# EAGLE schematic vmem_test (EAGLE 6.2)
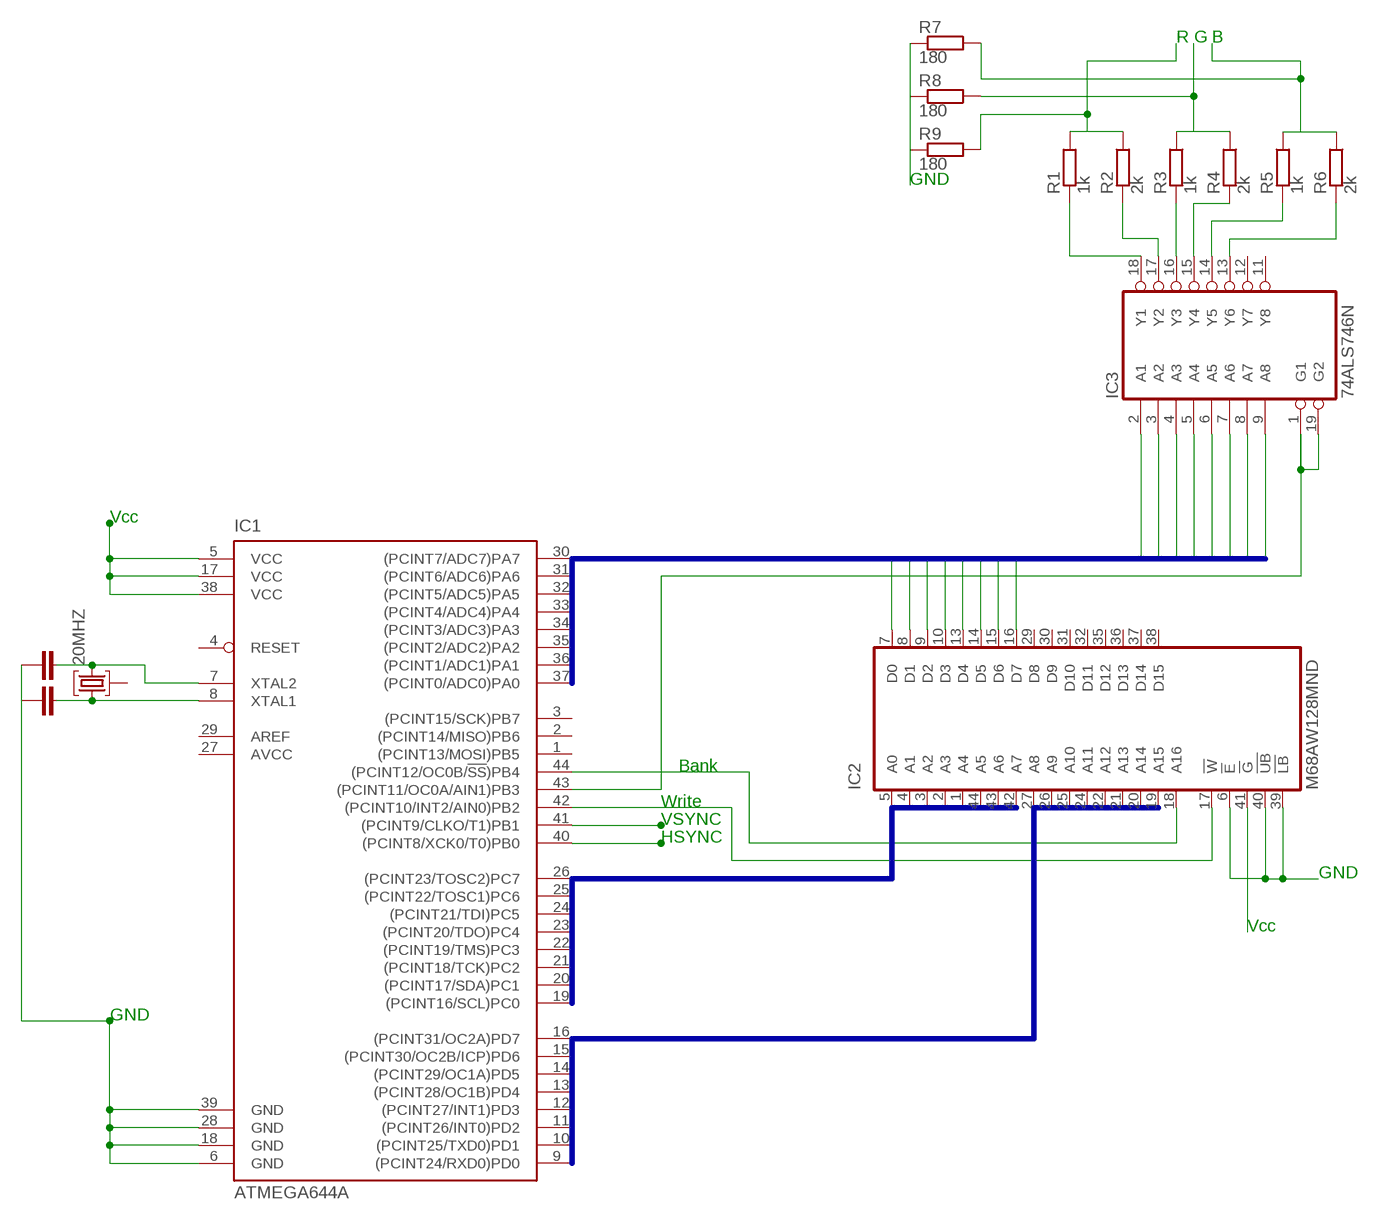
[diagram p0: schematic, sheet 1]

## Parts
20MHZ  12M10AHC49HT  [HC49U]
IC1  ATMEGA644A  [TQFP44]
IC2  M68AW128MND  [TSOP44-II]
IC3  74ALS746N  [DIL20]
R1  1k  BVS  [BVS]
R2  2k  BVS  [BVS]
R3  1k  BVS  [BVS]
R4  2k  BVS  [BVS]
R5  1k  BVS  [BVS]
R6  2k  BVS  [BVS]
R7  180  BVS  [BVS]
R8  180  BVS  [BVS]
R9  180  BVS  [BVS]

## Nets
N$1: IC1.5(VCC) IC1.17(VCC) IC1.38(VCC)
N$2: IC1.6(GND) IC1.18(GND) IC1.28(GND) IC1.39(GND)
N$3: IC2.7(D0)
N$4: IC2.8(D1)
N$5: IC2.9(D2)
N$6: IC2.10(D3)
N$7: IC2.13(D4)
N$8: IC2.14(D5)
N$9: 20MHZ.3 IC1.7(XTAL2)
N$10: 20MHZ.1 IC1.8(XTAL1)
N$11: IC2.15(D6)
N$12: IC2.16(D7)
N$13: IC3.2(A1)
N$14: IC3.3(A2)
N$15: IC3.4(A3)
N$16: IC3.5(A4)
N$17: IC3.6(A5)
N$18: IC3.7(A6)
N$19: IC3.8(A7)
N$20: IC3.9(A8)
N$21: IC1.40((PCINT8/XCK0/T0)PB0)
N$22: IC1.41((PCINT9/CLKO/T1)PB1)
N$23: IC2.41(!G)
N$24: IC2.6(!E) IC2.39(!LB) IC2.40(!UB)
N$25: IC1.43((PCINT11/OC0A/AIN1)PB3) IC3.1(G1) IC3.19(G2)
N$26: IC1.42((PCINT10/INT2/AIN0)PB2) IC2.17(!W)
N$27: IC3.18(Y1) R1.2
N$28: IC3.17(Y2) R2.2
N$29: IC3.16(Y3) R3.2
N$30: IC3.15(Y4) R4.2
N$31: IC3.13(Y6) R6.2
N$32: IC3.14(Y5) R5.2
N$33: R7.1
N$34: R3.1 R4.1 R8.1
N$35: R9.1
N$36: R1.1 R2.1
N$37: R5.1 R6.1
N$38: R7.2
N$40: IC1.44((PCINT12/OC0B/!SS!)PB4) IC2.18(A16)
Unconnected: 20MHZ.2 IC1.1((PCINT13/MOSI)PB5) IC1.2((PCINT14/MISO)PB6) IC1.3((PCINT15/SCK)PB7) IC1.4(RESET) IC1.9((PCINT24/RXD0)PD0) IC1.10((PCINT25/TXD0)PD1) IC1.11((PCINT26/INT0)PD2) IC1.12((PCINT27/INT1)PD3) IC1.13((PCINT28/OC1B)PD4) IC1.14((PCINT29/OC1A)PD5) IC1.15((PCINT30/OC2B/ICP)PD6) IC1.16((PCINT31/OC2A)PD7) IC1.19((PCINT16/SCL)PC0) IC1.20((PCINT17/SDA)PC1) IC1.21((PCINT18/TCK)PC2) IC1.22((PCINT19/TMS)PC3) IC1.23((PCINT20/TDO)PC4) IC1.24((PCINT21/TDI)PC5) IC1.25((PCINT22/TOSC1)PC6) IC1.26((PCINT23/TOSC2)PC7) IC1.29(AREF) IC1.30((PCINT7/ADC7)PA7) IC1.31((PCINT6/ADC6)PA6) IC1.32((PCINT5/ADC5)PA5) IC1.33((PCINT4/ADC4)PA4) IC1.34((PCINT3/ADC3)PA3) IC1.35((PCINT2/ADC2)PA2) IC1.36((PCINT1/ADC1)PA1) IC1.37((PCINT0/ADC0)PA0) IC2.1(A4) IC2.2(A3) IC2.3(A2) IC2.4(A1) IC2.5(A0) IC2.19(A15) IC2.20(A14) IC2.21(A13) IC2.22(A12) IC2.24(A11) IC2.25(A10) IC2.26(A9) IC2.27(A8) IC2.29(D8) IC2.30(D9) IC2.31(D10) IC2.32(D11) IC2.35(D12) IC2.36(D13) IC2.37(D14) IC2.38(D15) IC2.42(A7) IC2.43(A6) IC2.44(A5) IC3.11(Y8) IC3.12(Y7) R8.2 R9.2

## Buses
B$1
B$2
B$3

## Notes on the sheet
- R | G | B
- GND
- Vcc
- Bank
- Write
- VSYNC
- HSYNC
- GND
- Vcc
- GND

## Power pins joined to a net without a drawn wire
AVCC: IC1.27(AVCC)
GND: IC3.10(GND)
VCC: IC2.11(VCC) IC2.33(VCC) IC3.20(VCC)
VSS: IC2.12(VSS) IC2.34(VSS)

## Library data of the parts
20MHZ = crystal:12M10AHC49HT: Monolithic Crystal Filters Source: www.vanlong.com; OC_FARNELL: unknown; OC_NEWARK: unknown
IC1 = atmel:ATMEGA644: 8-bit Microcontroller with 64K Bytes In-System Programmable Flash Source: http://www.atmel.com/dyn/resources/prod_documents/doc2593.pdf; MPN: ATMEGA644PV-10AU; OC_FARNELL: 1455123; OC_NEWARK: 58M3748
IC2 = st-microelectronics:M68AW128M: 2 Mbit (128K x16) 3.0V Asynchronous SRAM Source: Source: http://us.st.com/stonline/products/literature/ds/7995.pdf; OC_FARNELL: unknown; OC_NEWARK: unknown
IC3 = 74xx-eu:74*746: Octal BUS DRIVER, inverting, pull-up resistors
R1-R9 = resistor-shunt:BVS: SMD SHUNT RESISTOR; OC_FARNELL: unknown; OC_NEWARK: unknown